# EAGLE design Gyro_SinarX (EAGLE 9.6.2)
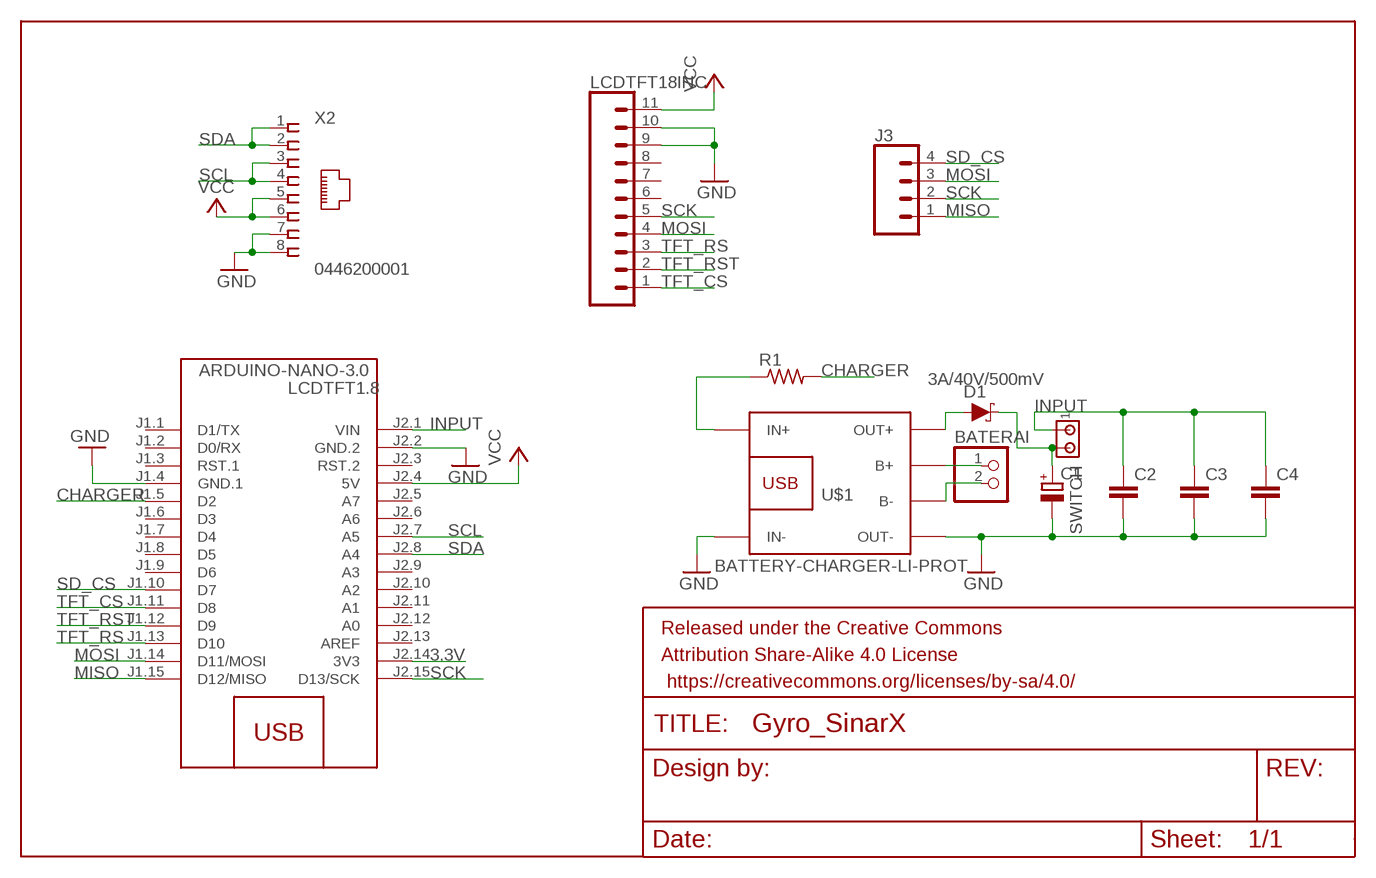
[diagram p0: schematic, sheet 1]

## Parts
BATERAI  PINHD-1X2/90  [1X02/90]
C1  CPOL-EUE2.5-7  [E2,5-7]
C2  C-EUC0805K  [C0805K]
C3  C-EUC0805K  [C0805K]
C4  C-EUC0805K  [C0805K]
D1  3A/40V/500mV  DIODE-SCHOTTKY-B340A  [SMA-DIODE]
FRAME1  FRAME-LEDGER  [CREATIVE_COMMONS]
J3  CONN_04PTH  [1X04]
LCDTFT1.8  ARDUINO-NANO-3.0  [ARDUINO-NANO-3.0]
LCDTFT18INC  CONN_11  [1X11]
R1  R-US_0207/10  [0207/10]
SWITCH  MTA02-100  [10X02MTA]
U$1  BATTERY-CHARGER-LI-PROT  [BATTERY-CHARGER-LI-PROT]
X2  0446200001  [0446200001]

## Nets
3.3V: LCDTFT1.8.J2.14(3V3)
CHARGER: LCDTFT1.8.J1.5(D2) R1.2
GND: C1.- C2.2 C3.2 C4.2 LCDTFT1.8.J1.4(GND.1) LCDTFT1.8.J2.2(GND.2) LCDTFT18INC.9 LCDTFT18INC.10 U$1.IN- U$1.OUT- X2.7 X2.8
INPUT: C2.1 C3.1 C4.1 LCDTFT1.8.J2.1(VIN) SWITCH.1
MISO: J3.1 LCDTFT1.8.J1.15(D12/MISO)
MOSI: J3.3 LCDTFT1.8.J1.14(D11/MOSI) LCDTFT18INC.4
N$1: D1.A U$1.OUT+
N$7: R1.1 U$1.IN+
N$9: C1.+ D1.C SWITCH.2
N$14: BATERAI.1 U$1.B+
N$15: BATERAI.2 U$1.B-
SCK: J3.2 LCDTFT1.8.J2.15(D13/SCK) LCDTFT18INC.5
SCL: LCDTFT1.8.J2.7(A5) X2.3 X2.4
SD_CS: J3.4 LCDTFT1.8.J1.10(D7)
SDA: LCDTFT1.8.J2.8(A4) X2.1 X2.2
TFT_CS: LCDTFT1.8.J1.11(D8) LCDTFT18INC.1
TFT_RS: LCDTFT1.8.J1.13(D10) LCDTFT18INC.3
TFT_RST: LCDTFT1.8.J1.12(D9) LCDTFT18INC.2
VCC: LCDTFT1.8.J2.4(5V) LCDTFT18INC.11 X2.5 X2.6
Unconnected: LCDTFT1.8.J1.1(D1/TX) LCDTFT1.8.J1.2(D0/RX) LCDTFT1.8.J1.3(RST.1) LCDTFT1.8.J1.6(D3) LCDTFT1.8.J1.7(D4) LCDTFT1.8.J1.8(D5) LCDTFT1.8.J1.9(D6) LCDTFT1.8.J2.3(RST.2) LCDTFT1.8.J2.5(A7) LCDTFT1.8.J2.6(A6) LCDTFT1.8.J2.9(A3) LCDTFT1.8.J2.10(A2) LCDTFT1.8.J2.11(A1) LCDTFT1.8.J2.12(A0) LCDTFT1.8.J2.13(AREF) LCDTFT18INC.6 LCDTFT18INC.7 LCDTFT18INC.8

## Library data of the parts
BATERAI = pinhead:PINHD-1X2: PIN HEADER
C1 = rcl:CPOL-EU: POLARIZED CAPACITOR, European symbol; SPICEPREFIX: C
C2-C4 = rcl:C-EU: CAPACITOR, European symbol; SPICEPREFIX: C
D1 = SparkFun-DiscreteSemi:DIODE-SCHOTTKY: Schottky diode A Schottky diode is a semiconductor diode which has a low forward voltage drop and a very fast switching action.; PROD_ID: DIO-09886
FRAME1 = SparkFun-Aesthetics:FRAME-LEDGER: Schematic Frame - Ledger Standard 11x14 US Ledger frame
J3 = SparkFun-Connectors:CONN_04: Multi connection point. Often used as Generic Header-pin footprint for 0.1 inch spaced/style header connections On any of the 0.1 inch spaced packages, you can populate with these: Break Away Headers - Straight <https://www.sparkfun.com/products/116> (PRT-00116) Break Away Male Headers - Right Angle <https://www.sparkfun.com/products/553> (PRT-00553) Female Headers <https://www.sparkfun.com/products/115> (PRT-00115) Break Away Headers - Machine Pin <https://www.sparkfun.com/products/117> (PRT-00117) Break Away Female Headers - Swiss Machine Pin <https://www.sparkfun.com/products/743> (PRT-00743) For SCREWTERMINALS and SPRING TERMINALS visit here: Screw Terimnals on SparkFun.com <https://www.sparkfun.com/search/results?term=Screw+Terminals> (5mm/3.5mm/2.54mm spacing) This device is also useful as a general connection point to wire up your design to another part of your project. Our various solder wires solder well into these plated through hole pads. Hook-Up Wire - Assortment (Stranded, 22 AWG) <https://www.sparkfun.com/products/11375> (PRT-11375) Hook-Up Wire - Assortment (Solid Core, 22 AWG) <https://www.sparkfun.com/products/11367> (PRT-11367) View the entire wire category on our website here <https://www.sparkfun.com/categories/141> Special notes: Molex polarized connector foot print use with SKU : PRT-08231 with associated crimp pins and housings. 1MM SMD Version SKU: PRT-10208; PROD_ID: CONN-09696
LCDTFT1.8 = diy-modules:ARDUINO-NANO-3.0: Arduino Nano 3.0 and compatible devices More details available here: https://www.arduino.cc/en/Main/ArduinoBoardNano Click here to find device on ebay.com <http://www.ebay.com/sch/arduino+nano>
LCDTFT18INC = SparkFun-Connectors:CONN_11: Multi connection point. Often used as Generic Header-pin footprint for 0.1 inch spaced/style header connections On any of the 0.1 inch spaced packages, you can populate with these: Break Away Headers - Straight <https://www.sparkfun.com/products/116> (PRT-00116) Break Away Male Headers - Right Angle <https://www.sparkfun.com/products/553> (PRT-00553) Female Headers <https://www.sparkfun.com/products/115> (PRT-00115) Break Away Headers - Machine Pin <https://www.sparkfun.com/products/117> (PRT-00117) Break Away Female Headers - Swiss Machine Pin <https://www.sparkfun.com/products/743> (PRT-00743) For SCREWTERMINALS and SPRING TERMINALS visit here: Screw Terimnals on SparkFun.com <https://www.sparkfun.com/search/results?term=Screw+Terminals> (5mm/3.5mm/2.54mm spacing) This device is also useful as a general connection point to wire up your design to another part of your project. Our various solder wires solder well into these plated through hole pads. Hook-Up Wire - Assortment (Stranded, 22 AWG) <https://www.sparkfun.com/products/11375> (PRT-11375) Hook-Up Wire - Assortment (Solid Core, 22 AWG) <https://www.sparkfun.com/products/11367> (PRT-11367) View the entire wire category on our website here <https://www.sparkfun.com/categories/141>
R1 = rcl:R-US_: RESISTOR, American symbol; SPICEPREFIX: R
SWITCH = con-amp:MTA02-100: AMP connector
U$1 = diy-modules:BATTERY-CHARGER-LI-PROT: Lithium Battery 5V Charger with protection circuit More details available here: http://www.instructables.com/id/DIY-Lithium-ion-Battery-Charger/step4/TP4056-based-lithium-ion-battery-charger-module/ Click here to find device on ebay.com <http://www.ebay.com/sch/tp4056+charger+usb+protection>
X2 = con-molex:0446200001: RJ-45 INVERTED MODULAR JACK ASSEMBLY WITH RJ-11 KEEPOUT FEATURE Source: Data sheet <http://www.farnell.com/datasheets/73207.pdf>; MF: MOLEX; OC_FARNELL: unknown

## Board
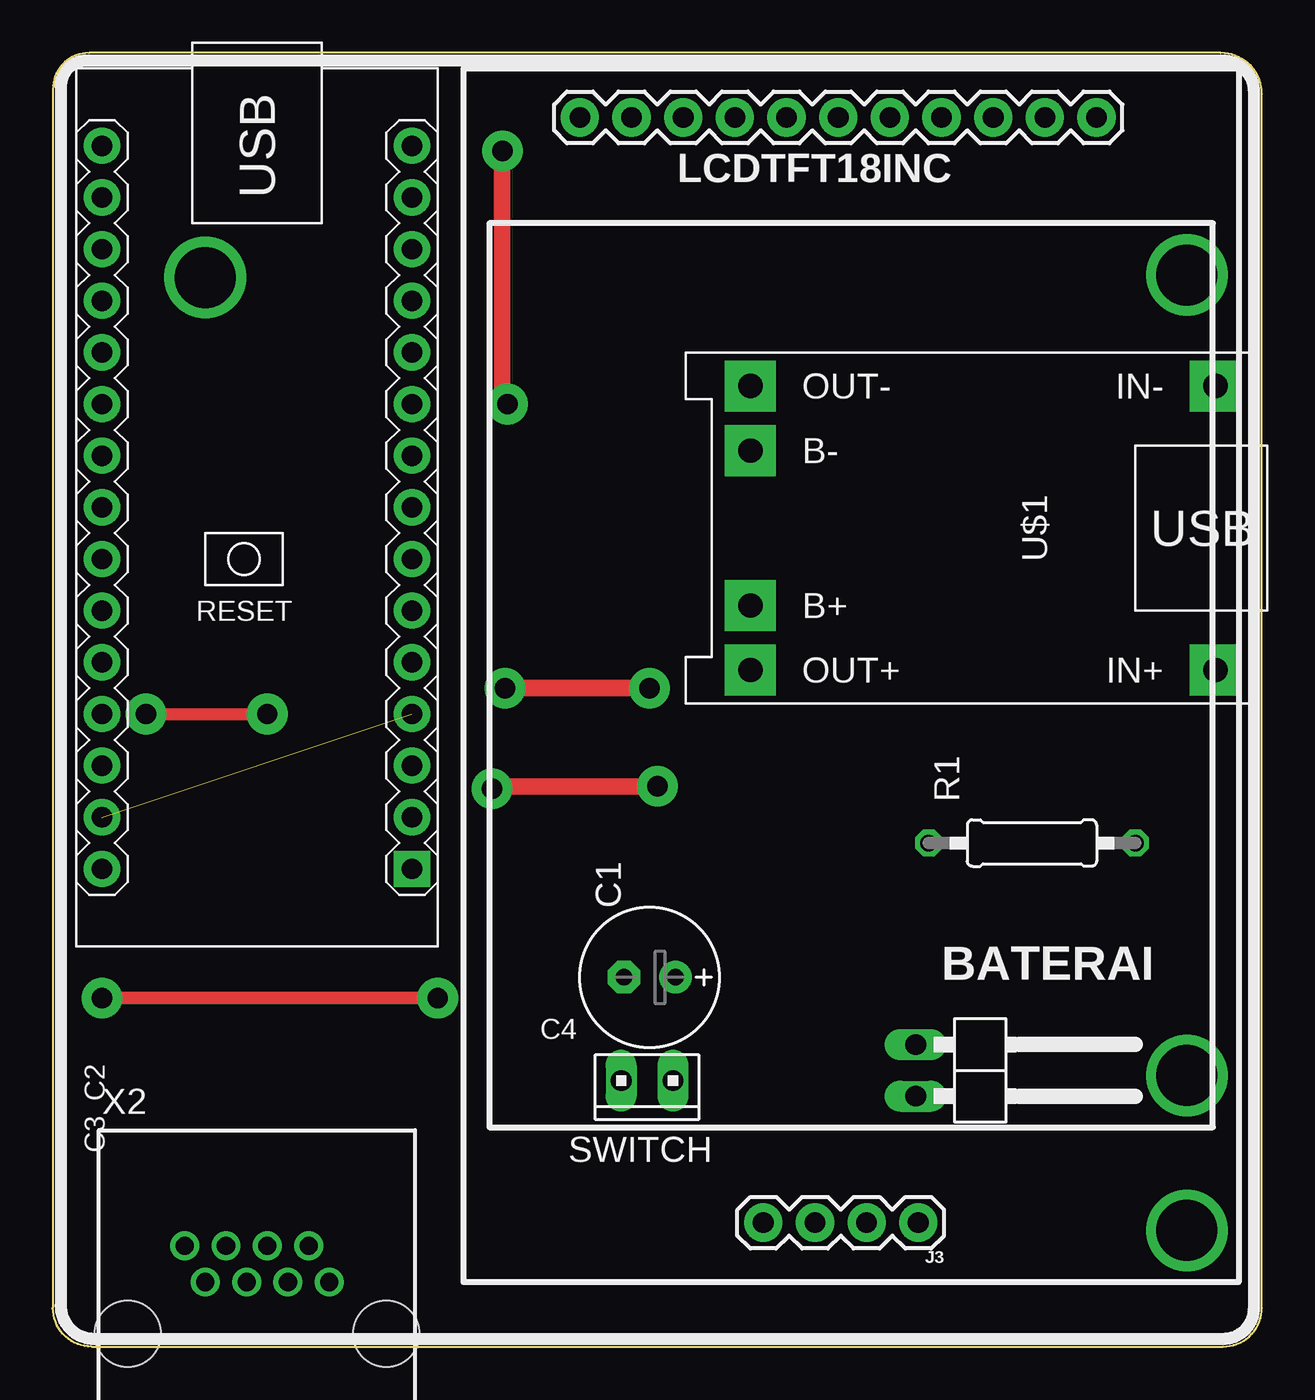
[diagram p1: board, top side]
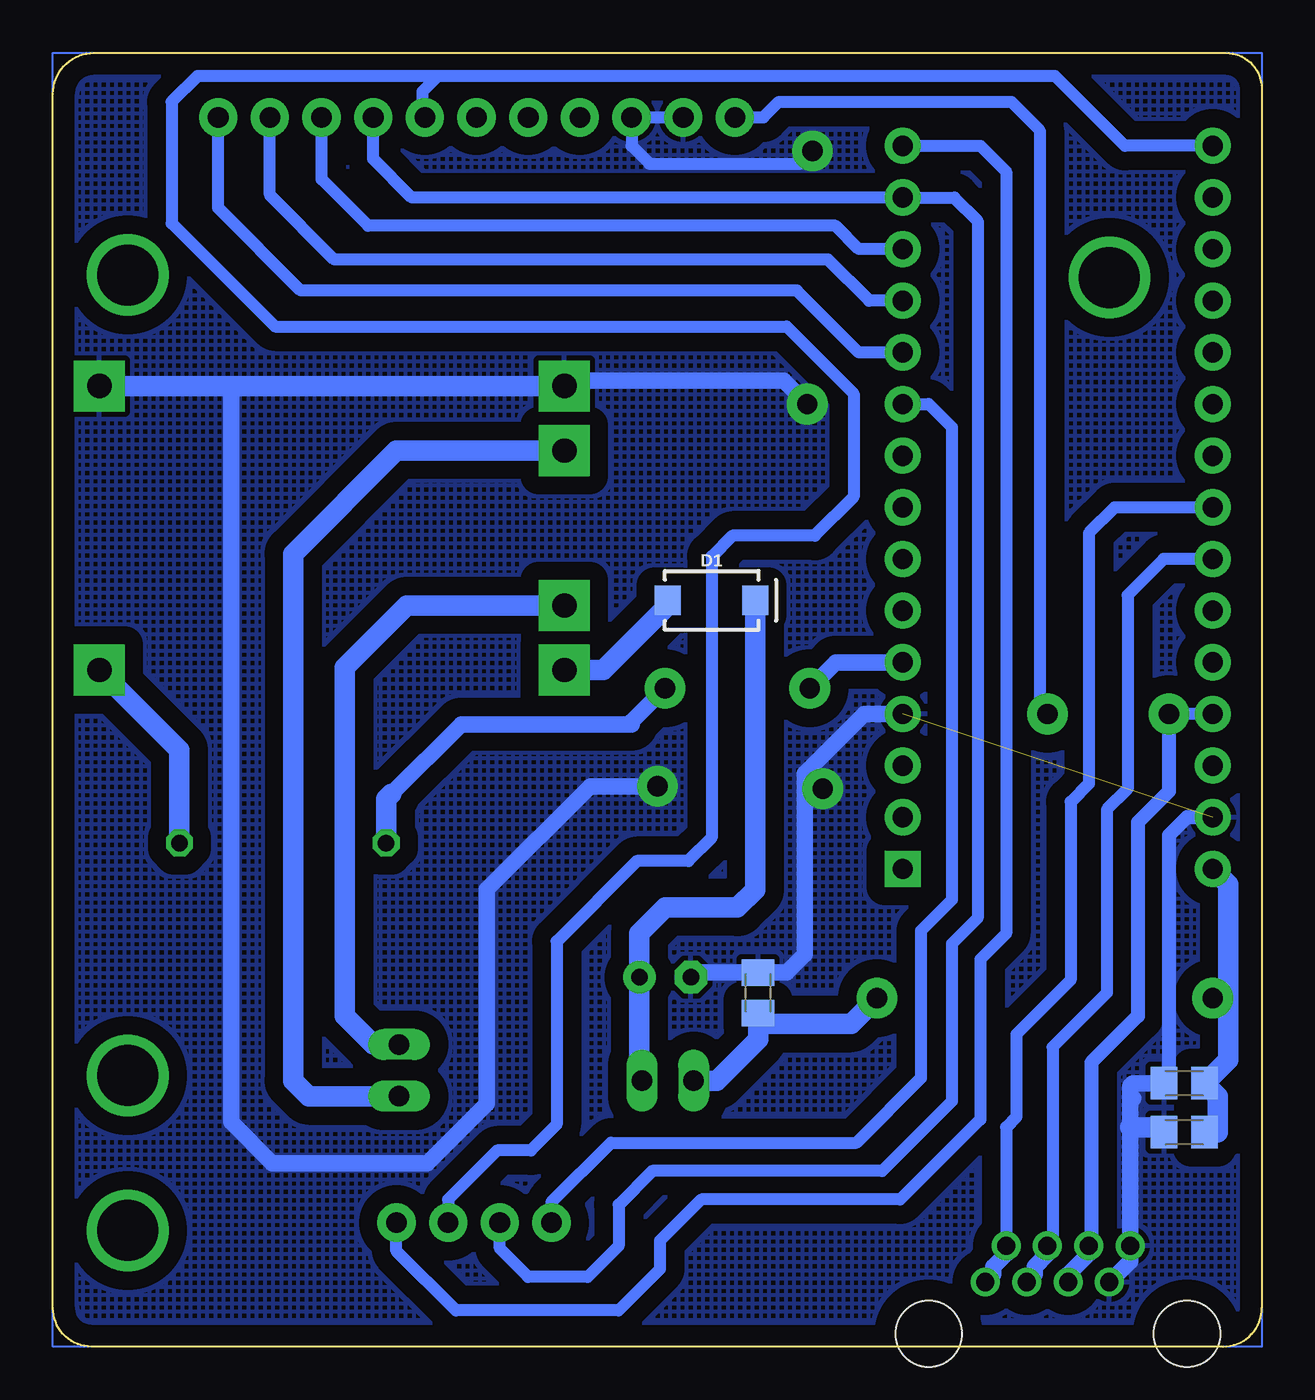
[diagram p2: board, bottom side, seen from below]

Size 59.44 x 63.63 mm. Coordinates in mm from the lower left corner, seen from the top.
Outline: 1.91,0 57.53,0 arc90 59.44,1.9 59.44,61.6 arc90 57.4,63.63 1.78,63.63 arc90 0,61.85 0,1.9 arc90 1.91,0
Copper layers (1*16): Top 0.035mm / dielectric 1.5mm / Bottom 0.035mm
Design rules "default": minimum track width 6mil, minimum drill 0.35mm, track to track 6mil, track to pad 6mil, pad to pad 6mil, via to via 6mil, smd to smd 6mil, copper to edge 40mil, drill to drill 6mil, minimum pad ring 10mil, minimum via ring 8mil, stop-mask expansion 4mil, vias tented up to drill 0mil, thermal gap 10mil

### Footprints (pad centres in the part's own frame; a part is rotated, then mirrored left to right if it is on the bottom)
1X02/90 = drill 1.016 long: 1 -1.27,-3.81; 2 1.27,-3.81
E2,5-7 = drill 0.813 pad 1.6: + -1.27,0 | drill 0.813 pad 1.6 octagon: - 1.27,0
C0805K = smd 1.3 x 1.6: 1 -1,0; 2 1,0
SMA-DIODE = smd 1.27 x 1.47: A -2.15,0; C 2.15,0
1X04 = drill 1.016 pad 1.88: 1 0,0; 2 2.54,0; 3 5.08,0; 4 7.62,0
ARDUINO-NANO-3.0 = drill 1 pad 1.778 square: J1.1 17.78,7.62 | drill 1 pad 1.778: J1.2 15.24,7.62; J1.3 12.7,7.62; J1.4 10.16,7.62; J1.5 7.62,7.62; J1.6 5.08,7.62; J1.7 2.54,7.62; J1.8 0,7.62; J1.9 -2.54,7.62; J1.10 -5.08,7.62; J1.11 -7.62,7.62; J1.12 -10.16,7.62; J1.13 -12.7,7.62; J1.14 -15.24,7.62; J1.15 -17.78,7.62; J2.1 17.78,-7.62; J2.2 15.24,-7.62; J2.3 12.7,-7.62; J2.4 10.16,-7.62; J2.5 7.62,-7.62; J2.6 5.08,-7.62; J2.7 2.54,-7.62; J2.8 0,-7.62; J2.9 -2.54,-7.62; J2.10 -5.08,-7.62; J2.11 -7.62,-7.62; J2.12 -10.16,-7.62; J2.13 -12.7,-7.62; J2.14 -15.24,-7.62; J2.15 -17.78,-7.62
1X11 = drill 1.016 pad 1.88: 1 0,0; 2 2.54,0; 3 5.08,0; 4 7.62,0; 5 10.16,0; 6 12.7,0; 7 15.24,0; 8 17.78,0; 9 20.32,0; 10 22.86,0; 11 25.4,0
0207/10 = drill 0.813 octagon: 1 -5.08,0; 2 5.08,0
10X02MTA = drill 1.016 long: 1 1.27,0; 2 -1.27,0
BATTERY-CHARGER-LI-PROT = drill 1.2 pad 2.5 square: B+ 10.795,3.81; B- 10.795,-3.81; IN+ -12.065,6.985; IN- -12.065,-6.985; OUT+ 10.795,6.985; OUT- 10.795,-6.985
0446200001 = drill 0.889 pad 1.422: 1 3.556,2.54; 2 2.54,4.318; 3 1.524,2.54; 4 0.508,4.318; 5 -0.508,2.54; 6 -1.524,4.318; 7 -2.54,2.54; 8 -3.556,4.318 | hole 3.251: 6.35,0; -6.35,0

### Placement (x,y rotation side)
BATERAI  46.23,13.59 270 top
C1  29.34,18.16 180 top
C2  3.81,12.95 180 bottom
C3  3.81,10.54 180 bottom
C4  24.77,17.4 90 bottom
D1  27.05,36.7 0 bottom
FRAME1  4.95,-17.14 0 top  (outside the outline)
J3  42.55,6.1 180 top
LCDTFT1.8  10.03,41.27 270 top
LCDTFT18INC  51.31,60.45 180 top
R1  48.13,24.77 180 top
SWITCH  29.21,13.08 180 top
U$1  45.09,40.26 180 top
X2  10.03,0.63 0 top

### Tracks (layer width: path | path; a pad name or v marks a point on that pad's centre or on a via)
CHARGER  (via drill 1 pad 2)
  Top 0.8: v22.23,32.38 v29.34,32.38
  Bottom 0.8: LCDTFT1.8.J1.5 20.95,33.66 v22.23,32.38 | v29.34,32.38 30.99,30.73 30.99,30.61 39.37,30.61 42.8,27.18
  Bottom 1: 42.8,27.18 43.05,26.92 R1.2
GND  (via drill 1 pad 2)  (1 unrouted)
  Top 0.8: v22.1,58.8 22.1,46.61 v22.35,46.35 | v29.72,27.56 21.72,27.56 v21.59,27.43
  Bottom 0.6: LCDTFT18INC.10 LCDTFT18INC.9 30.99,59.05 30.1,58.17 22.73,58.17 v22.1,58.8
  Bottom 0.7: LCDTFT1.8.J2.2 3.68,26.03 4.57,25.15 4.57,13.19 C2.2
  Bottom 0.8: X2.7 6.48,4.19 X2.8 6.48,10.79 6.48,12.06 | 6.48,12.06 6.48,12.83 6.35,12.95 C2.2 | 6.33,12.21 6.48,12.06 | C1.- 27.83,18.4 C4.2 23.37,18.4 22.48,19.29 22.48,26.67 | LCDTFT1.8.J1.4 19.56,31.12 22.48,28.19 22.48,26.67 | v22.35,46.35 23.5,47.5 34.04,47.5 U$1.OUT- | v21.59,27.43 21.72,27.43 22.48,26.67 | 50.67,47.24 50.67,11.05 48.64,9.02 41.02,9.02 38.1,11.94 38.1,22.48 33.02,27.56 v29.72,27.56
  Bottom 1: U$1.OUT- 50.67,47.24 U$1.IN- | C3.2 5.06,10.79 6.48,10.79
  pour Bottom (isolate 0.9, hatched): 0.38,0.38 59.06,0.38 59.06,63.25 0.38,63.25
INPUT  (via drill 1 pad 2)
  Top 0.61: v18.92,17.14 v2.41,17.14
  Bottom 0.8: 24.89,16.28 C4.1
  Bottom 1: C4.1 24.77,15.88 | 24.77,15.88 24.77,15.11 26.8,13.08 SWITCH.1 | 24.77,15.88 20.19,15.88 v18.92,17.14 | LCDTFT1.8.J2.1 1.65,22.73 1.65,17.02 | 1.65,17.02 1.65,14.11 C2.1 2.16,12.3 2.16,10.54 C3.1 | v2.41,17.14 2.29,17.02 1.65,17.02
MISO
  Bottom 0.6: LCDTFT1.8.J1.15 13.84,59.05 12.57,57.79 12.57,20.32 13.84,19.05 13.84,11.18 17.78,7.24 27.56,7.24 29.59,5.21 29.59,3.81 31.62,1.78 39.62,1.78 42.55,4.7 J3.1
MOSI
  Bottom 0.6: J3.3 37.47,4.83 36.07,3.43 33.15,3.43 31.62,4.95 31.62,6.98 29.97,8.64 18.67,8.64 15.24,12.06 15.24,19.81 13.97,21.08 13.97,55.37 15.11,56.51 LCDTFT1.8.J1.14 41.78,56.51 43.69,58.42 LCDTFT18INC.4
N$1
  Bottom 1: D1.A 29.2,36.46 32.38,33.27 U$1.OUT+
N$2  (via drill 3 pad 2)
  other vias: 55.75,52.71
N$3  (via drill 3 pad 2)
  other vias: 55.75,5.71
N$4  (via drill 3 pad 2)
  other vias: 7.49,52.58
N$5  (via drill 3 pad 2)
  other vias: 55.75,13.34
N$6
  Bottom 0.1: 0,0 59.44,0 59.44,63.63 0,63.63 0,0
N$7
  Bottom 1: U$1.IN+ 53.21,29.34 R1.1
N$9
  Bottom 1: D1.C 24.9,22.47 25.78,21.59 29.34,21.59 30.61,20.32 C1.+ 30.61,13.21 SWITCH.2
N$14
  Bottom 1: U$1.B+ 42.04,36.45 45.09,33.4 45.09,16.26 43.69,14.86 BATERAI.1
N$15
  Bottom 1: U$1.B- 42.55,44.07 47.62,38.99 47.62,13.08 46.86,12.32 BATERAI.2
SCK
  Bottom 0.6: LCDTFT1.8.J2.15 6.73,59.05 10.16,62.48 40.51,62.48 | 40.51,62.48 41.27,61.72 41.27,60.58 LCDTFT18INC.5 | 40.51,62.48 52.32,62.48 53.59,61.21 53.59,55.24 48.51,50.16 23.37,50.16 20.07,46.86 20.07,41.78 21.97,39.88 26.04,39.88 27.05,38.86 27.05,25.02 28.19,23.88 30.73,23.88 34.67,19.94 34.67,10.92 35.94,9.65 37.59,9.65 40.01,7.24 J3.2
SCL
  Bottom 0.6: LCDTFT1.8.J2.7 4.83,38.73 6.6,36.96 6.6,27.43 7.62,26.42 7.62,17.4 10.29,14.73 10.29,5.21 X2.4
  Bottom 0.8: X2.4 10.54,4.57 11.18,3.94 11.18,3.56 X2.3
SD_CS
  Bottom 0.6: LCDTFT1.8.J1.10 16.38,46.35 15.24,45.21 15.24,21.97 16.76,20.45 16.76,13.21 19.94,10.03 32,10.03 34.93,7.11 J3.4
SDA
  Bottom 0.6: LCDTFT1.8.J2.8 7.24,41.27 8.51,40.01 8.51,27.69 9.4,26.8 9.4,18.03 12.06,15.37 12.06,11.3 12.57,10.79 X2.2 12.32,5.21
  Bottom 0.8: X2.1 13.21,3.56 13.21,3.94 12.57,4.57 X2.2
TFT_CS
  Bottom 0.6: LCDTFT18INC.1 51.31,56.01 47.24,51.94 22.86,51.94 19.81,48.89 LCDTFT1.8.J1.11
TFT_RS
  Bottom 0.6: LCDTFT1.8.J1.13 19.81,53.98 20.95,55.12 43.94,55.12 46.23,57.4 LCDTFT18INC.3
TFT_RST
  Bottom 0.6: LCDTFT1.8.J1.12 19.3,51.43 21.34,53.47 45.59,53.47 48.77,56.64 LCDTFT18INC.2
VCC  (via drill 1 pad 2)
  Top 0.6: v4.57,31.12 v10.54,31.12
  Bottom 0.6: LCDTFT18INC.11 24.51,60.45 23.75,61.21 12.32,61.21 10.92,59.82 10.92,31.5 v10.54,31.12 | LCDTFT1.8.J2.4 v4.57,31.12
  Bottom 0.7: X2.6 8.38,5.08 8.38,13.97 6.1,16.26 6.1,25.78 4.57,27.3 v4.57,31.12
  Bottom 0.8: X2.6 8.51,4.57 9.53,3.56 X2.5